# EAGLE design DRV8711 (EAGLE 9.4.0)
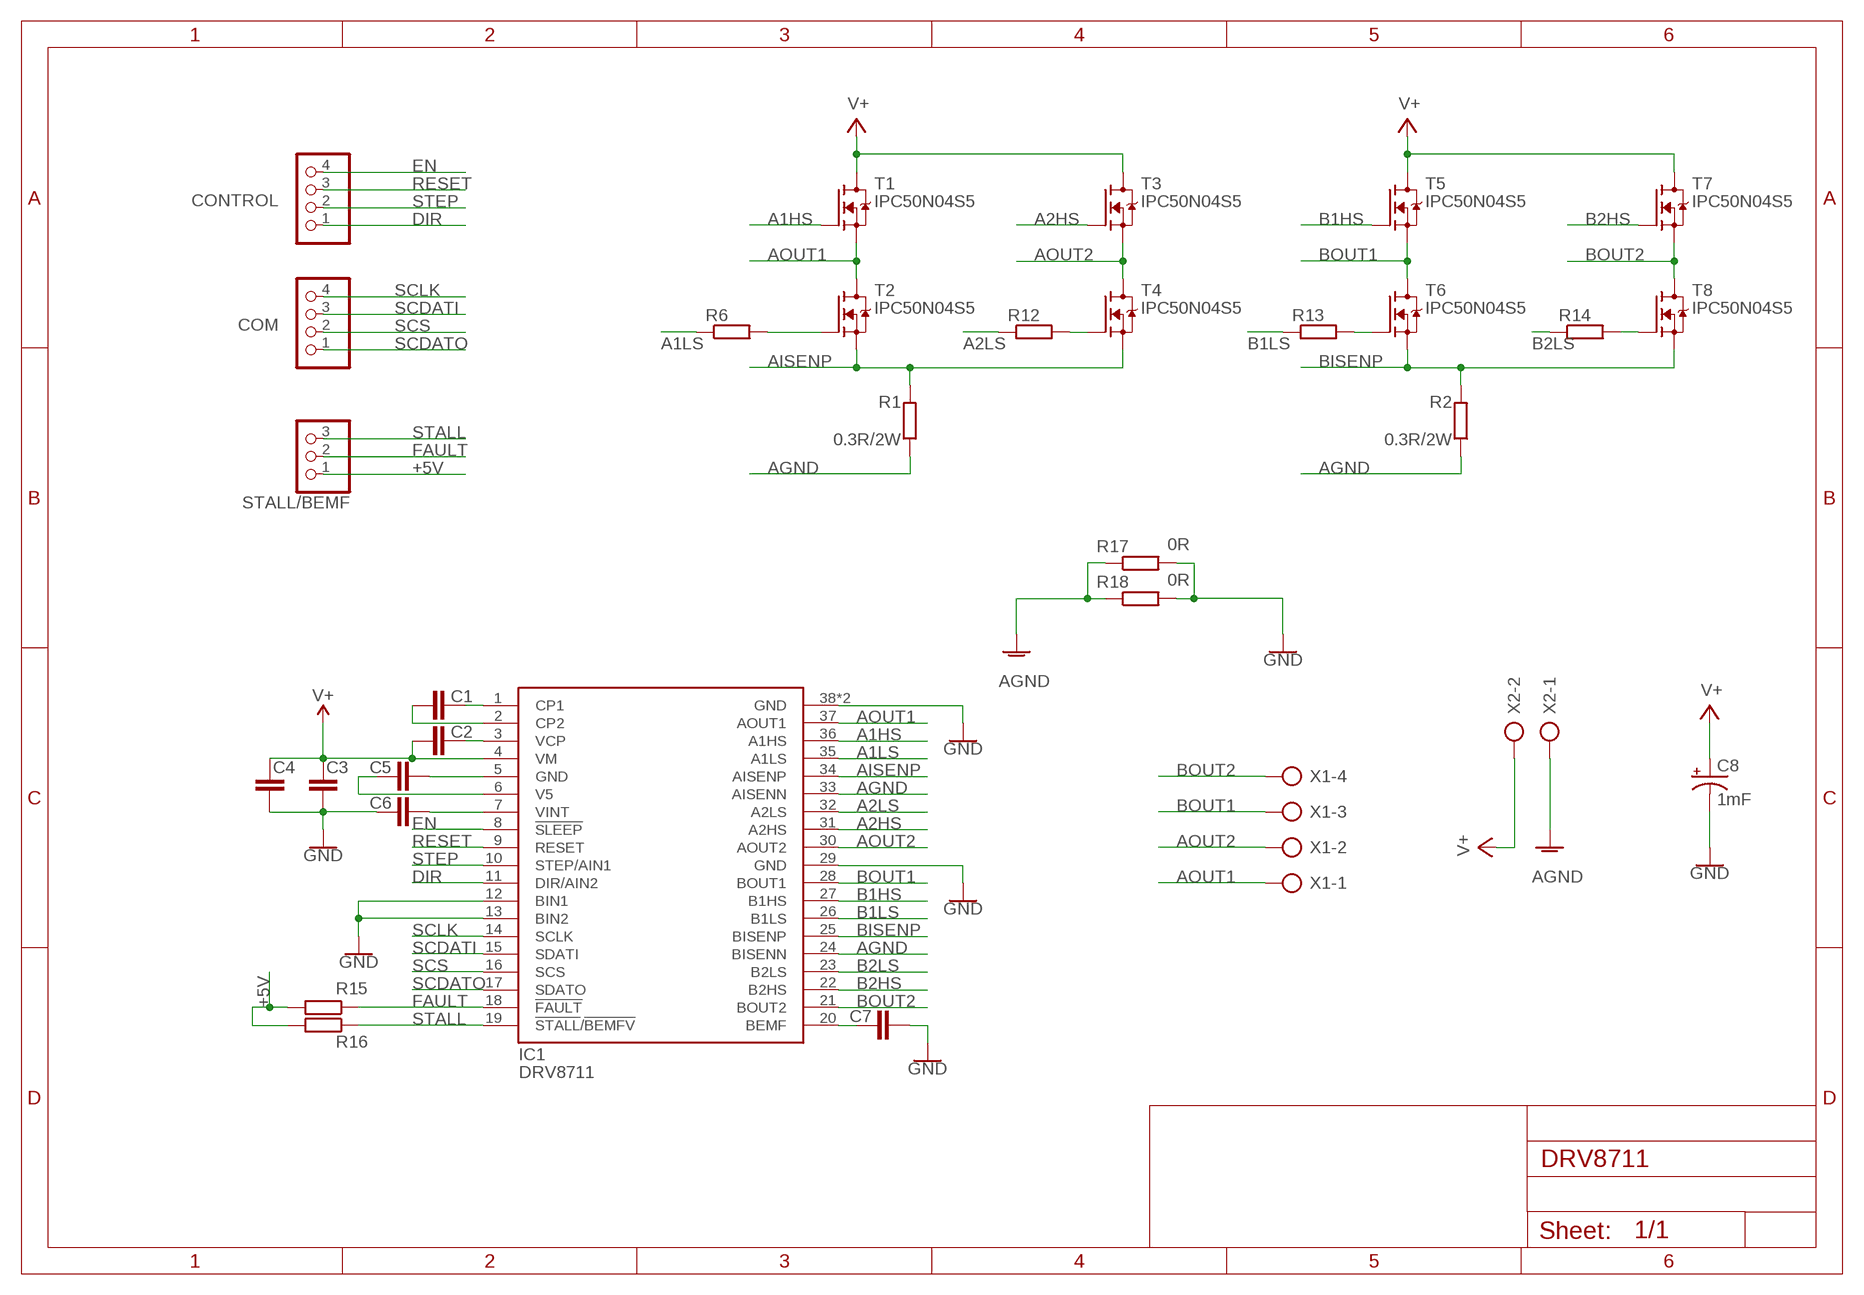
[diagram p0: schematic, sheet 1]

## Parts
C1  C-EUC0805  [C0805]
C2  C-EUC0805  [C0805]
C3  C-EUC0805  [C0805]
C4  C-EUC0805  [C0805]
C5  C-EUC0805  [C0805]
C6  C-EUC0805  [C0805]
C7  C-EUC0805  [C0805]
C8  1mF  1000UF-RADIAL-5MM-25V-20%  [CPOL-RADIAL-5MM-10MM]
COM  PINHD-1X4  [1X04]
CONTROL  PINHD-1X4  [1X04]
IC1  DRV8711  [R-PDSO-G38]
R1  0.3R/2W  R-EU_R2512  [R2512]
R2  0.3R/2W  R-EU_R2512  [R2512]
R6  R-EU_R0805  [R0805]
R12  R-EU_R0805  [R0805]
R13  R-EU_R0805  [R0805]
R14  R-EU_R0805  [R0805]
R15  R-EU_R0805  [R0805]
R16  R-EU_R0805  [R0805]
R17  0R  R-EU_R0805  [R0805]
R18  0R  R-EU_R0805  [R0805]
STALL/BEMF  PINHD-1X3  [1X03]
T1  IPC50N04S5  [PG-TDSON-8-33]
T2  IPC50N04S5  [PG-TDSON-8-33]
T3  IPC50N04S5  [PG-TDSON-8-33]
T4  IPC50N04S5  [PG-TDSON-8-33]
T5  IPC50N04S5  [PG-TDSON-8-33]
T6  IPC50N04S5  [PG-TDSON-8-33]
T7  IPC50N04S5  [PG-TDSON-8-33]
T8  IPC50N04S5  [PG-TDSON-8-33]
X1  AK500/4  [AK500/4]
X2  AK500/2  [AK500/2]

## Nets
+5V: R15.2 R16.2 STALL/BEMF.1
A1HS: IC1.36(A1HS) T1.3(G)
A1LS: IC1.35(A1LS) R6.1
A2HS: IC1.31(A2HS) T3.3(G)
A2LS: IC1.32(A2LS) R12.1
AGND: IC1.24(BISENN) IC1.33(AISENN) R1.1 R2.1 R17.1 R18.1 X2.1
AISENP: IC1.34(AISENP) R1.2 T2.2(S) T4.2(S)
AOUT1: IC1.37(AOUT1) T1.2(S) T2.1(D) X1.1
AOUT2: IC1.30(AOUT2) T3.2(S) T4.1(D) X1.2
B1HS: IC1.27(B1HS) T5.3(G)
B1LS: IC1.26(B1LS) R13.1
B2HS: IC1.22(B2HS) T7.3(G)
B2LS: IC1.23(B2LS) R14.1
BISENP: IC1.25(BISENP) R2.2 T6.2(S) T8.2(S)
BOUT1: IC1.28(BOUT1) T5.2(S) T6.1(D) X1.3
BOUT2: IC1.21(BOUT2) T7.2(S) T8.1(D) X1.4
DIR: CONTROL.1 IC1.11(DIR/AIN2)
EN: CONTROL.4 IC1.8(!SLEEP)
FAULT: IC1.18(!FAULT) R15.1 STALL/BEMF.2
GND: C3.1 C4.1 C5.1 C6.2 C7.1 C8.- IC1.5(GND) IC1.12(BIN1) IC1.13(BIN2) IC1.29(GND) IC1.38(GND) IC1.PAD(GND) R17.2 R18.2
N$1: R14.2 T8.3(G)
N$2: R6.2 T2.3(G)
N$3: R12.2 T4.3(G)
N$4: R13.2 T6.3(G)
N$5: C1.2 IC1.1(CP1)
N$6: C1.1 IC1.2(CP2)
N$7: C2.2 IC1.3(VCP)
N$8: C7.2 IC1.20(BEMF)
N$9: C5.2 IC1.6(V5)
N$10: C6.1 IC1.7(VINT)
RESET: CONTROL.3 IC1.9(RESET)
SCDATI: COM.3 IC1.15(SDATI)
SCDATO: COM.1 IC1.17(SDATO)
SCLK: COM.4 IC1.14(SCLK)
SCS: COM.2 IC1.16(SCS)
STALL: IC1.19(!STALL!/!BEMFV!) R16.1 STALL/BEMF.3
STEP: CONTROL.2 IC1.10(STEP/AIN1)
V+: C2.1 C3.2 C4.2 C8.+ IC1.4(VM) T1.1(D) T3.1(D) T5.1(D) T7.1(D) X2.2

## Library data of the parts
C1-C7 = rcl:C-EU: CAPACITOR, European symbol; SPICEPREFIX: C
C8 = SparkFun-Capacitors:1000UF: 1,000µF/1mF ceramic capacitors A capacitor is a passive two-terminal electrical component used to store electrical energy temporarily in an electric field. CAP-08070; PROD_ID: CAP-09538
COM CONTROL = pinhead:PINHD-1X4: PIN HEADER
IC1 = drivers:DRV8711
R1 R2 R6 R12-R18 = rcl:R-EU_: RESISTOR, European symbol; SPICEPREFIX: R
STALL/BEMF = pinhead:PINHD-1X3: PIN HEADER
T1-T8 = transistors:IPC50N04S5
X1 = con-ptr500:AK500/4: CONNECTOR; OC_FARNELL: unknown; OC_NEWARK: unknown
X2 = con-ptr500:AK500/2: CONNECTOR; OC_FARNELL: unknown; OC_NEWARK: unknown

## Board
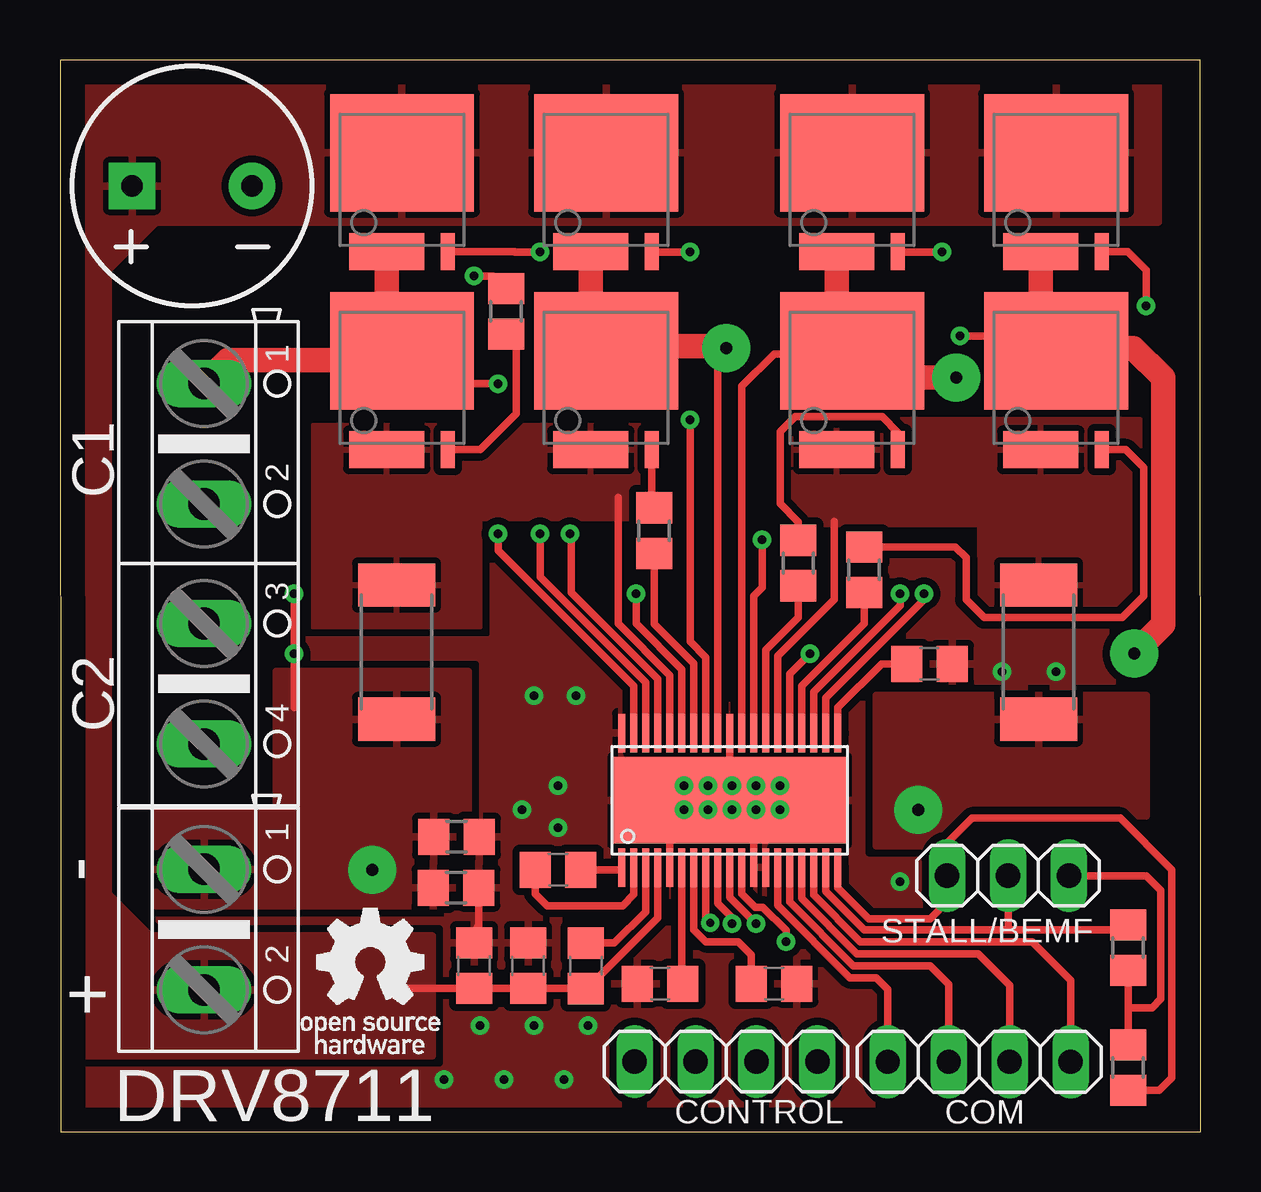
[diagram p1: board, top side]
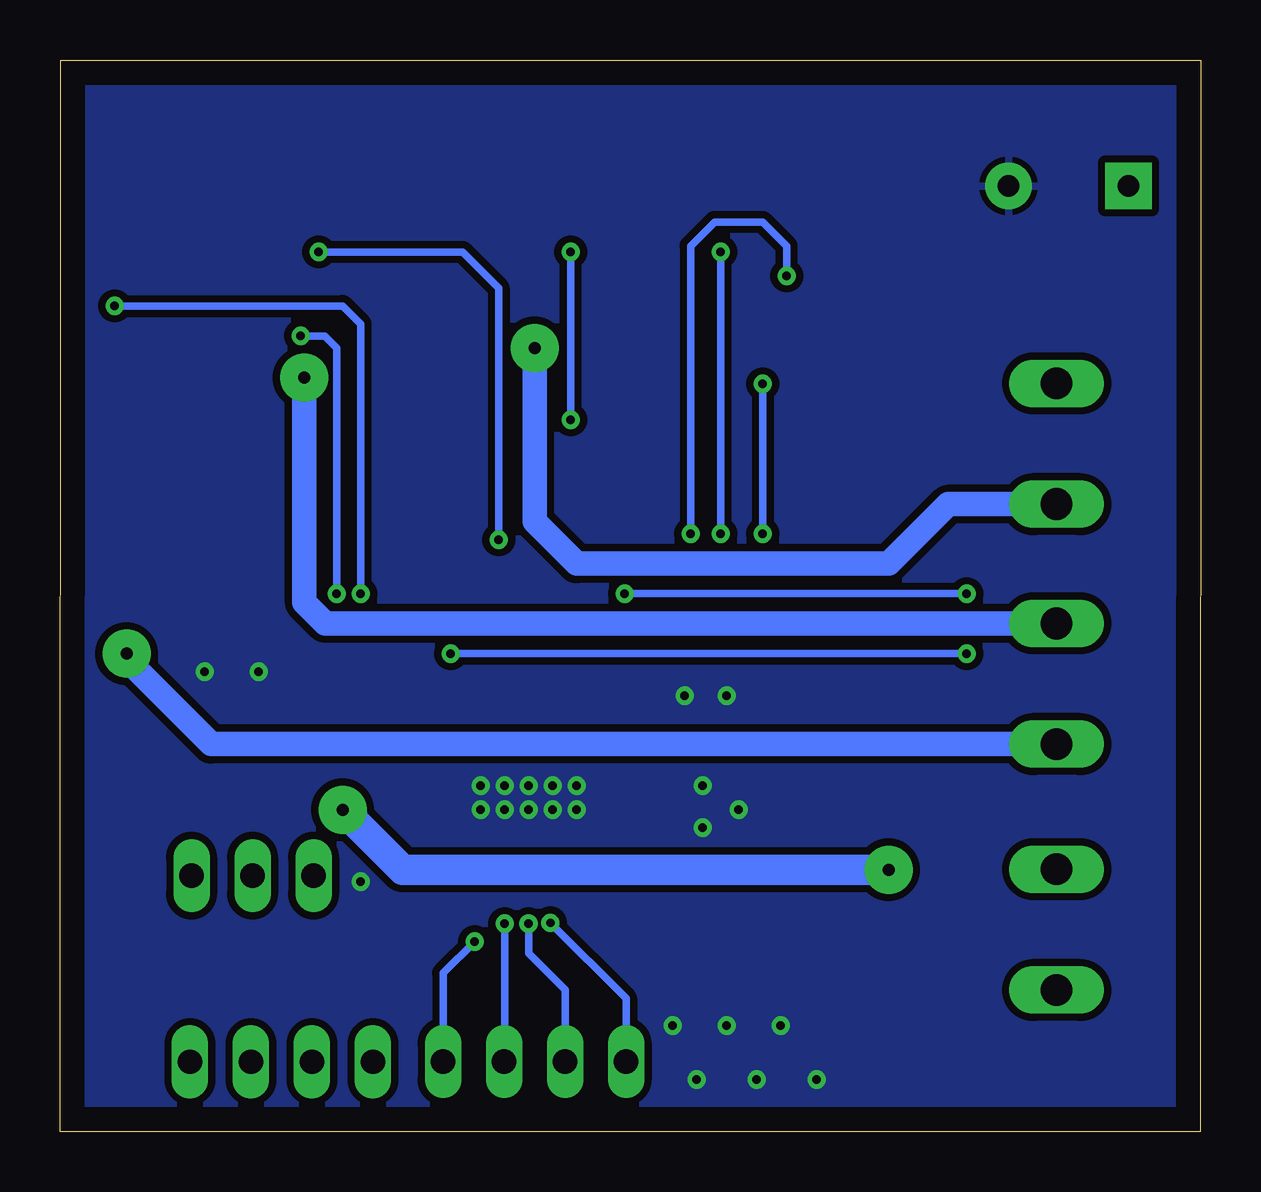
[diagram p2: board, bottom side, seen from below]

Size 47.53 x 44.68 mm. Coordinates in mm from the lower left corner, seen from the top.
Outline: 0.03,0 47.53,0 47.5,44.68 0,44.68 0.03,0
Copper layers (1*16): Top 0.035mm / dielectric 1.5mm / Bottom 0.035mm
Design rules "default": minimum track width 6mil, minimum drill 0.35mm, track to track 6mil, track to pad 6mil, pad to pad 6mil, via to via 6mil, smd to smd 6mil, copper to edge 40mil, drill to drill 6mil, minimum pad ring 10mil, minimum via ring 8mil, stop-mask expansion 4mil, vias tented up to drill 0mil, thermal gap 10mil

### Footprints (pad centres in the part's own frame; a part is rotated, then mirrored left to right if it is on the bottom)
C0805 = smd 1.3 x 1.5: 1 -0.95,0; 2 0.95,0
CPOL-RADIAL-5MM-10MM = drill 0.9 pad 1.93 square: + 2.5,0 | drill 0.9 pad 1.93: - -2.5,0
1X04 = drill 1.016 long: 1 -3.81,0; 2 -1.27,0; 3 1.27,0; 4 3.81,0
R-PDSO-G38 = smd 0.3 x 1.6: 1 -4.5,-2.8; 2 -4,-2.8; 3 -3.5,-2.8; 4 -3,-2.8; 5 -2.5,-2.8; 6 -2,-2.8; 7 -1.5,-2.8; 8 -1,-2.8; 9 -0.5,-2.8; 10 0,-2.8; 11 0.5,-2.8; 12 1,-2.8; 13 1.5,-2.8; 14 2,-2.8; 15 2.5,-2.8; 16 3,-2.8; 17 3.5,-2.8; 18 4,-2.8; 19 4.5,-2.8; 20 4.5,2.8; 21 4,2.8; 22 3.5,2.8; 23 3,2.8; 24 2.5,2.8; 25 2,2.8; 26 1.5,2.8; 27 1,2.8; 28 0.5,2.8; 29 0,2.8; 30 -0.5,2.8; 31 -1,2.8; 32 -1.5,2.8; 33 -2,2.8; 34 -2.5,2.8; 35 -3,2.8; 36 -3.5,2.8; 37 -4,2.8; 38 -4.5,2.8 | smd 9.7 x 3.6: PAD 0,0
R2512 = smd 1.8 x 3.2: 1 -2.8,0; 2 2.8,0
R0805 = smd 1.3 x 1.5: 1 -0.95,0; 2 0.95,0
1X03 = drill 1.016 long: 1 -2.54,0; 2 0,0; 3 2.54,0
PG-TDSON-8-33 = smd 6 x 4.9: 1 0,1.13 | smd 3.14 x 1.55: 2 -0.635,-2.995 | smd 0.6 x 1.55: 3 1.905,-2.995
AK500/4 = drill 1.321 long: 1 -7.518,0; 2 -2.489,0; 3 2.489,0; 4 7.518,0
AK500/2 = drill 1.321 long: 1 -2.515,0; 2 2.515,0

### Placement (x,y rotation side)
C1  20.75,10.93 0 top
C2  21.91,6.92 90 top
C3  19.5,6.93 270 top
C4  17.25,6.93 270 top
C5  25,6.18 0 top
C6  29.75,6.18 0 top
C7  36.23,19.51 180 top
C8  5.5,39.43 180 top
COM  38.3,2.92 180 top
CONTROL  27.75,2.93 180 top
IC1  27.91,13.82 0 top
R1  14.03,20 90 top
R2  40.78,20 90 top
R6  18.59,34.2 270 top
R12  24.76,25.06 90 top
R13  30.76,23.71 90 top
R14  33.5,23.43 90 top
R15  44.5,7.68 270 top
R16  44.5,2.68 90 top
R17  16.52,12.3 0 top
R18  16.5,10.18 0 top
STALL/BEMF  39.5,10.68 180 top
T1  14.25,39.68 0 top
T2  14.25,31.43 0 top
T3  22.75,39.68 0 top
T4  22.75,31.43 0 top
T5  33,39.68 0 top
T6  33,31.43 0 top
T7  41.5,39.68 0 top
T8  41.5,31.43 0 top
X1  6,23.68 270 top
X2  6,8.43 270 top

### Tracks (layer width: path | path; a pad name or v marks a point on that pad's centre or on a via)
+5V
  Top 0.305: R15.2 44.5,5.18 | 44.5,5.18 R16.2 | 44.5,5.18 45.5,5.18 45.87,5.56 45.87,10.06 45.25,10.68 STALL/BEMF.1
A1HS  (via drill 0.35 pad 0.7)
  Top 0.305: IC1.36 24.41,18.73 20,23.14 v20,24.93 | T1.3 18.94,36.69 18.95,36.68 v20,36.68
  Bottom 0.305: v20,24.93 v20,36.68
A1LS  (via drill 0.35 pad 0.7)
  Top 0.305: IC1.35 24.91,18.88 21.3,22.48 21.3,24.88 v21.25,24.93 | R6.1 18.06,35.68 v17.25,35.68
  Bottom 0.305: v17.25,35.68 17.25,36.93 18.25,37.93 20.25,37.93 21.25,36.93 v21.25,24.93
A2HS  (via drill 0.35 pad 0.7)
  Top 0.305: IC1.31 26.91,19.77 26.25,20.43 v26.25,29.68 | v26.25,36.68 T3.3
  Bottom 0.305: v26.25,29.68 v26.25,36.68
A2LS
  Top 0.305: IC1.32 26.41,19.52 24.76,21.17 R12.1
AGND  (via drill 0.35 pad 0.7, 0.5 pad 2)
  Top 0.305: IC1.24 30.41,19.09 v31.25,19.93 | IC1.33 25.91,19.27 24,21.18 v24,22.43 | v9.75,22.43 v9.75,19.93 9.75,17.68
  Bottom 0.305: v24,22.43 v9.75,22.43 | v31.25,19.93 v9.75,19.93
  Bottom 1.27: v13,10.93 33.25,10.93 v35.75,13.43
  pour Top (isolate 0.305): 9,19.18 17,19.18 17,9.43 4,9.43 4,13.43 9,13.43
  pour Top (isolate 0.305): 34,18.18 45.25,18.18 45.25,13.18 38,13.18 36.75,11.93 34,11.93
AISENP
  Top 0.305: IC1.34 25.41,19.02 23.25,21.18 23.25,26.43
  pour Top (isolate 0.305): 10.53,29.5 25.53,29.5 25.53,25.5 17.53,25.5 17.53,21 10.53,21
AOUT1  (via drill 0.35 pad 0.7)
  Top 0.305: IC1.37 23.91,18.58 18.25,24.24 v18.25,24.93 | v18.25,31.18 15.25,31.18 14.25,32.18
  Top 1.016: T1.2 13.62,32.18 | 13.62,32.18 14.25,32.18 15,32.18 14.62,32.56 T2.1 | X1.1 6.98,32.18 13.62,32.18
  Bottom 0.305: v18.25,31.18 v18.25,24.93
AOUT2  (via drill 0.5 pad 2)
  Top 0.305: 22.57,32.75 T4.1 | T4.1 22.88,32.43 | IC1.30 27.41,32.47 27.69,32.75 | T4.1 22.12,31.93
  Top 1.016: 22.12,31.93 T3.2 | v27.75,32.68 27.69,32.75 22.57,32.75
  Bottom 1.016: v27.75,32.68 27.75,25.43 26,23.68 13,23.68 10.51,26.17 X1.2
B1HS  (via drill 0.35 pad 0.7)
  Top 0.305: IC1.27 28.91,22.34 29.25,22.68 v29.25,24.68 | v36.75,36.68 T5.3
  Bottom 0.305: v29.25,24.68 29.25,35.18 30.75,36.68 v36.75,36.68
B1LS
  Top 0.305: IC1.26 29.41,20.09 30.76,21.44 R13.1
B2HS  (via drill 0.35 pad 0.7)
  Top 0.305: IC1.22 31.41,18.34 35,21.93 v35,22.43 | v45.25,34.43 45.25,35.93 44.5,36.69 T7.3
  Bottom 0.305: v35,22.43 35,33.68 35.75,34.43 v45.25,34.43
B2LS
  Top 0.305: IC1.23 30.91,18.59 33.5,21.18 R14.1
BISENP
  Top 0.305: IC1.25 29.91,19.84 32.25,22.18 32.25,25.43
  pour Top (isolate 0.305): 29.78,29.75 45.03,29.75 45.03,20.25 38.28,20.25 38.28,25.25 29.78,25.25
BOUT1  (via drill 0.5 pad 2)
  Top 0.305: IC1.28 28.41,31.09 29.75,32.43 32.37,32.43 32.87,32.43 T6.1
  Top 1.016: T5.2 32.37,32.43 33.5,32.43 34.5,31.43 v37.35,31.43
  Bottom 1.016: v37.35,31.43 37.35,22.06 36.48,21.19 X1.3
BOUT2  (via drill 0.35 pad 0.7, 0.5 pad 2)
  Top 0.305: v36,22.43 36,22.18 31.91,18.09 IC1.21 | v37.5,33.18 40.37,33.18 40.87,32.68
  Top 1.016: 40.87,32.68 T7.2 | T8.1 40.99,32.56 40.87,32.68 | 40.87,32.68 44.73,32.68 45.98,31.43 45.98,21.16 v44.75,19.93
  Bottom 0.305: v37.5,33.18 36.5,33.18 36,32.68 v36,22.43
  Bottom 1.016: v44.75,19.93 44.75,19.68 41.23,16.16 X1.4
DIR  (via drill 0.35 pad 0.7)
  Top 0.305: IC1.11 28.41,9.93 28.98,9.36 29.28,9.36 30.25,8.4 v30.25,7.93
  Bottom 0.305: CONTROL.1 31.56,6.62 v30.25,7.93
EN  (via drill 0.35 pad 0.7)
  Top 0.305: IC1.8 26.91,8.9 v27.09,8.71
  Bottom 0.305: v27.09,8.71 23.94,5.56 CONTROL.4
FAULT
  Top 0.305: IC1.18 31.91,10.02 33.5,8.43 39.5,8.43 | R15.1 44.3,8.43 39.5,8.43 | STALL/BEMF.2 39.5,8.43
GND  (via drill 0.35 pad 0.7)
  Top 0.305: C4.1 17.25,8.38 17.45,8.58 R18.2 | IC1.12 28.91,12.34 28.75,12.5 | 28.75,12.5 28.47,12.5 28.25,12.71 | IC1.5 25.41,12.09 25,12.5 | 24.47,14.86 24.07,14.46 24.07,12.9 24.47,12.5 25,12.5 | IC1.PAD IC1.29 | IC1.PAD 28.75,12.98 28.75,12.5 | IC1.PAD 26.59,12.5 25,12.5
  other vias: 26,14.43 27,14.43 28,14.43 29,14.43 30,14.43 26,13.43 27,13.43 28,13.43 29,13.43 30,13.43 39.25,19.18 41.5,19.18 17.5,4.43 19.75,4.43 22,4.43 18.5,2.18 21,2.18 21.5,18.18 16,2.18 19.75,18.18 20.75,14.43 35,10.43 19.25,13.43 20.75,12.68
  pour Bottom (isolate 0.305): 0.25,44.43 47.25,44.43 47.25,0.18 0.25,0.18
  pour Top (isolate 0.305, rank 2): 0.25,0.18 47.25,0.18 47.25,44.43 0.25,44.43
N$1
  Top 0.305: R14.2 37.3,24.38 37.75,23.93 37.75,22.18 38.5,21.43 44.25,21.43 45.16,22.34 45.16,27.68 44.41,28.44 T8.3
N$2
  Top 0.305: T2.3 17.51,28.44 19,29.93 19,32.84 R6.2
N$3
  Top 0.305: R12.2 24.66,26.12 T4.3
N$4
  Top 0.305: R13.2 30.76,25.42 30,26.18 30,29.18 30.63,29.81 34.25,29.81 34.91,29.15 T6.3
N$5
  Top 0.305: IC1.1 23.32,10.93 C1.2
N$6
  Top 0.305: IC1.2 23.91,9.89 23.45,9.43 20.3,9.43 19.8,9.93 C1.1
N$7
  Top 0.305: IC1.3 24.41,9.18 23.1,7.87 C2.2
N$8
  Top 0.305: C7.2 34.24,19.51 32.41,17.68 IC1.20
N$9
  Top 0.305: IC1.6 25.91,6.22 C5.2
N$10
  Top 0.305: IC1.7 26.41,8.43 26.91,7.93 28.25,7.93 28.8,7.38 C6.1
RESET  (via drill 0.35 pad 0.7)
  Top 0.305: IC1.9 27.41,9.52 28,8.93 v28,8.68
  Bottom 0.305: v28,8.68 28,7.43 26.48,5.91 CONTROL.3
SCDATI
  Top 0.305: COM.3 37.03,6.15 36.25,6.93 33.06,6.93 30.41,9.58 IC1.15
SCDATO
  Top 0.305: COM.1 42.11,6.32 40.5,7.93 33.35,7.93 31.41,9.88 IC1.17
SCLK
  Top 0.305: COM.4 34.49,5.94 34,6.43 32.91,6.43 29.91,9.44 IC1.14
SCS
  Top 0.305: COM.2 39.57,6.11 38.25,7.43 33.21,7.43 30.91,9.73 IC1.16
STALL
  Top 0.305: IC1.19 32.41,10.17 33.69,8.89 36.25,8.89 36.96,9.6 STALL/BEMF.3 36.96,12.04 38,13.08 44.18,13.08 46.33,10.93 46.33,2.26 45.8,1.73 R16.1
STEP  (via drill 0.35 pad 0.7)
  Top 0.305: IC1.10 27.91,9.77 v29,8.68
  Bottom 0.305: v29,8.68 29,2.95 CONTROL.2
V+
  Top 0.305: IC1.4 24.91,8.93 21.95,5.97 C2.1 C3.2 C4.2 13.75,5.98
  pour Top (isolate 0.305): 0.25,3.18 15.5,3.18 15.5,8.18 3.75,8.18 2,9.93 2,35.93 4,37.93 45.75,37.93 45.75,44.18 0.25,44.18

### Text on the board
tNames: C1 | C2 | - | + | DRV8711